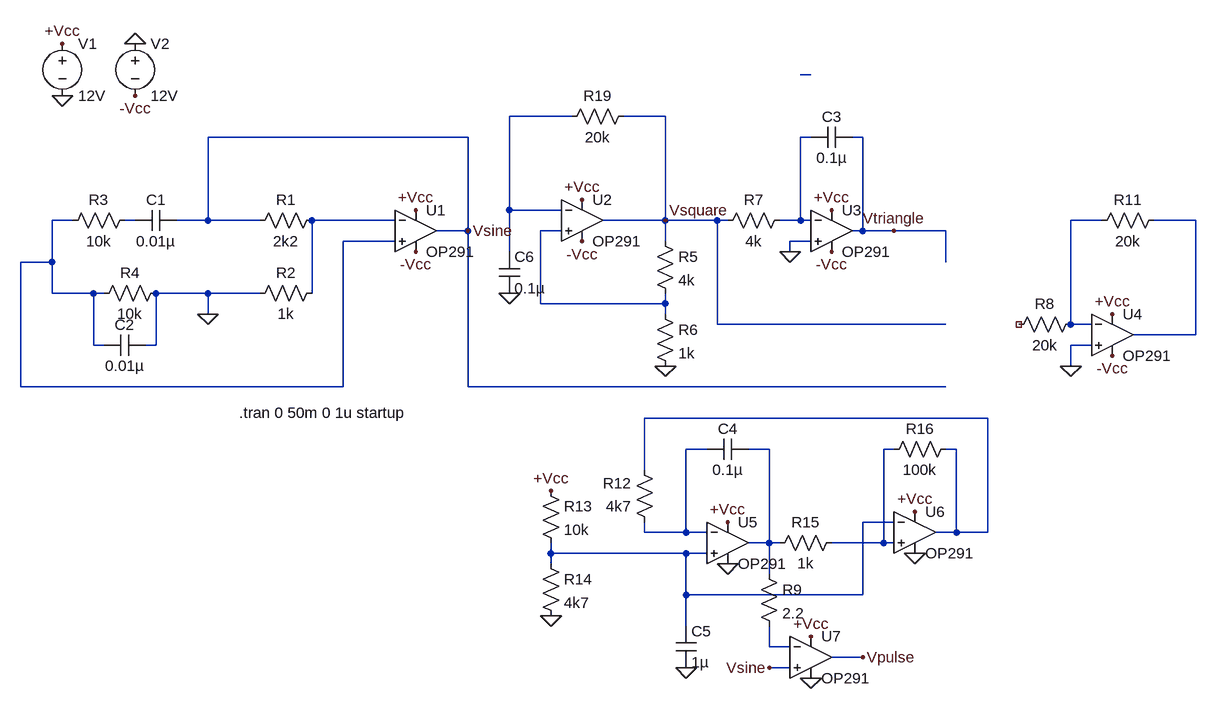
[diagram p0: schematic function_generator_seperated.asc]
function_generator_seperated.asc, the LTspice schematic file:
Version 4
SHEET 1 1520 1004
WIRE 816 -80 800 -80
WIRE 448 -16 352 -16
WIRE 592 -16 528 -16
WIRE 288 16 -112 16
WIRE 816 16 800 16
WIRE 896 16 880 16
WIRE 352 128 352 -16
WIRE 432 128 352 128
WIRE -320 144 -352 144
WIRE -224 144 -240 144
WIRE -112 144 -112 16
WIRE -112 144 -160 144
WIRE -32 144 -112 144
WIRE 176 144 48 144
WIRE 592 144 592 -16
WIRE 592 144 496 144
WIRE 672 144 592 144
WIRE 688 144 672 144
WIRE 800 144 800 16
WIRE 800 144 768 144
WIRE 816 144 800 144
WIRE 1264 144 1216 144
WIRE 1408 144 1344 144
WIRE 288 160 288 16
WIRE 288 160 240 160
WIRE 432 160 400 160
WIRE 896 160 896 16
WIRE 896 160 880 160
WIRE 944 160 896 160
WIRE 1024 160 944 160
WIRE 176 176 96 176
WIRE 592 176 592 144
WIRE 816 176 784 176
WIRE 352 192 352 128
WIRE 784 192 784 176
WIRE -352 208 -352 144
WIRE -352 208 -400 208
WIRE 1024 208 1024 160
WIRE -352 256 -352 208
WIRE -288 256 -352 256
WIRE -272 256 -288 256
WIRE -112 256 -192 256
WIRE -32 256 -112 256
WIRE 48 256 48 144
WIRE 400 272 400 160
WIRE 592 272 592 256
WIRE 592 272 400 272
WIRE -112 288 -112 256
WIRE 592 288 592 272
WIRE 672 304 672 144
WIRE 1024 304 672 304
WIRE 1216 304 1216 144
WIRE 1248 304 1216 304
WIRE 1408 320 1408 144
WIRE 1408 320 1312 320
WIRE -288 336 -288 256
WIRE -272 336 -288 336
WIRE -192 336 -192 256
WIRE -192 336 -208 336
WIRE 1248 336 1216 336
WIRE 1216 368 1216 336
WIRE -400 400 -400 208
WIRE 96 400 96 176
WIRE 96 400 -400 400
WIRE 288 400 288 160
WIRE 1024 400 288 400
WIRE 1088 448 560 448
WIRE 656 496 624 496
WIRE 752 496 720 496
WIRE 944 496 928 496
WIRE 1040 496 1024 496
WIRE 560 528 560 448
WIRE 944 608 896 608
WIRE 560 624 560 608
WIRE 624 624 624 496
WIRE 624 624 560 624
WIRE 656 624 624 624
WIRE 1040 624 1040 496
WIRE 1040 624 1008 624
WIRE 1088 624 1088 448
WIRE 1088 624 1040 624
WIRE 752 640 752 496
WIRE 752 640 720 640
WIRE 768 640 752 640
WIRE 928 640 928 496
WIRE 928 640 848 640
WIRE 944 640 928 640
WIRE 416 656 416 640
WIRE 624 656 416 656
WIRE 656 656 624 656
WIRE 416 672 416 656
WIRE 752 688 752 640
WIRE 624 720 624 656
WIRE 896 720 896 608
WIRE 896 720 624 720
WIRE 624 768 624 720
WIRE 752 800 752 768
WIRE 784 800 752 800
WIRE 896 816 848 816
WIRE 784 832 752 832
FLAG -112 288 0
FLAG 208 128 +Vcc
FLAG 208 192 -Vcc
FLAG 464 112 +Vcc
FLAG 464 176 -Vcc
FLAG -336 -48 0
FLAG -224 -128 0
FLAG -336 -128 +Vcc
FLAG -224 -48 -Vcc
FLAG 288 160 Vsine
FLAG 592 144 Vsquare
FLAG 592 368 0
FLAG 784 192 0
FLAG 848 128 +Vcc
FLAG 848 192 -Vcc
FLAG 944 160 Vtriangle
FLAG 416 560 +Vcc
FLAG 688 608 +Vcc
FLAG 416 752 0
FLAG 624 832 0
FLAG 688 672 0
FLAG 976 656 0
FLAG 976 592 +Vcc
FLAG 816 784 +Vcc
FLAG 896 816 Vpulse
FLAG 816 848 0
FLAG 352 256 0
FLAG 752 832 Vsine
FLAG 1280 352 -Vcc
FLAG 1280 288 +Vcc
FLAG 1216 368 0
SYMBOL res 64 128 R90
WINDOW 0 0 56 VBottom 2
WINDOW 3 32 56 VTop 2
SYMATTR InstName R1
SYMATTR Value 2k2
SYMBOL res 64 240 R90
WINDOW 0 0 56 VBottom 2
WINDOW 3 32 56 VTop 2
SYMATTR InstName R2
SYMATTR Value 1k
SYMBOL res -224 128 R90
WINDOW 0 0 56 VBottom 2
WINDOW 3 32 56 VTop 2
SYMATTR InstName R3
SYMATTR Value 10k
SYMBOL cap -160 128 R90
WINDOW 0 0 32 VBottom 2
WINDOW 3 32 32 VTop 2
SYMATTR InstName C1
SYMATTR Value 0.01µ
SYMBOL res -176 240 R90
WINDOW 0 0 56 VBottom 2
WINDOW 3 32 56 VTop 2
SYMATTR InstName R4
SYMATTR Value 10k
SYMBOL cap -208 320 R90
WINDOW 0 0 32 VBottom 2
WINDOW 3 32 32 VTop 2
SYMATTR InstName C2
SYMATTR Value 0.01µ
SYMBOL OpAmps\\OP291 464 80 R0
SYMATTR InstName U2
SYMBOL res 576 160 R0
SYMATTR InstName R5
SYMATTR Value 4k
SYMBOL res 576 272 R0
SYMATTR InstName R6
SYMATTR Value 1k
SYMBOL voltage -336 -144 R0
SYMATTR InstName V1
SYMATTR Value 12V
SYMBOL voltage -224 -144 R0
SYMATTR InstName V2
SYMATTR Value 12V
SYMBOL OpAmps\\OP291 208 96 R0
SYMATTR InstName U1
SYMBOL OpAmps\\OP291 848 96 R0
SYMATTR InstName U3
SYMBOL res 784 128 R90
WINDOW 0 0 56 VBottom 2
WINDOW 3 32 56 VTop 2
SYMATTR InstName R7
SYMATTR Value 4k
SYMBOL OpAmps\\OP291 688 576 R0
SYMATTR InstName U5
SYMBOL res 576 624 R180
WINDOW 0 36 76 Left 2
WINDOW 3 36 40 Left 2
SYMATTR InstName R12
SYMATTR Value 4k7
SYMBOL res 400 544 R0
SYMATTR InstName R13
SYMATTR Value 10k
SYMBOL res 400 656 R0
SYMATTR InstName R14
SYMATTR Value 4k7
SYMBOL res 864 624 R90
WINDOW 0 0 56 VBottom 2
WINDOW 3 32 56 VTop 2
SYMATTR InstName R15
SYMATTR Value 1k
SYMBOL cap 608 768 R0
SYMATTR InstName C5
SYMATTR Value 1µ
SYMBOL cap 720 480 R90
WINDOW 0 0 32 VBottom 2
WINDOW 3 32 32 VTop 2
SYMATTR InstName C4
SYMATTR Value 0.1µ
SYMBOL OpAmps\\OP291 976 560 R0
SYMATTR InstName U6
SYMBOL res 1040 480 R90
WINDOW 0 0 56 VBottom 2
WINDOW 3 32 56 VTop 2
SYMATTR InstName R16
SYMATTR Value 100k
SYMBOL OpAmps\\OP291 816 752 R0
SYMATTR InstName U7
SYMBOL res 544 -32 R90
WINDOW 0 0 56 VBottom 2
WINDOW 3 32 56 VTop 2
SYMATTR InstName R19
SYMATTR Value 20k
SYMBOL cap 336 192 R0
SYMATTR InstName C6
SYMATTR Value 0.1µ
SYMBOL cap 880 0 R90
WINDOW 0 0 32 VBottom 2
WINDOW 3 32 32 VTop 2
SYMATTR InstName C3
SYMATTR Value 0.1µ
SYMBOL OpAmps\\OP291 1280 256 R0
SYMATTR InstName U4
SYMBOL res 1360 128 R90
WINDOW 0 0 56 VBottom 2
WINDOW 3 32 56 VTop 2
SYMATTR InstName R11
SYMATTR Value 20k
SYMBOL res 1232 288 R90
WINDOW 0 0 56 VBottom 2
WINDOW 3 32 56 VTop 2
SYMATTR InstName R8
SYMATTR Value 20k
SYMBOL res 736 672 R0
SYMATTR InstName R9
SYMATTR Value 2.2
TEXT -64 440 Left 2 !.tran 0 50m 0 1u startup

The netlist it stands for:
* function_generator_seperated.asc
R1 N006 Vsine 2k2
R2 N006 0 1k
R3 N005 N004 10k
C1 Vsine N005 0.01µ
R4 0 N004 10k
C2 0 N004 0.01µ
XU2 N009 N002 +Vcc -Vcc Vsquare OP291  ; pins In+ In- V+ V- OUT
R5 Vsquare N009 4k
R6 N009 0 1k
V1 +Vcc 0 12V
V2 0 -Vcc 12V
XU1 N004 N006 +Vcc -Vcc Vsine OP291  ; pins In+ In- V+ V- OUT
XU3 0 N003 +Vcc -Vcc Vtriangle OP291  ; pins In+ In- V+ V- OUT
R7 N003 Vsquare 4k
XU5 N014 N011 +Vcc 0 N012 OP291  ; pins In+ In- V+ V- OUT
R12 N011 N010 4k7
R13 +Vcc N014 10k
R14 N014 0 4k7
R15 N013 N012 1k
C5 N014 0 1µ
C4 N012 N011 0.1µ
XU6 N013 N014 +Vcc 0 N010 OP291  ; pins In+ In- V+ V- OUT
R16 N010 N013 100k
XU7 Vsine N015 +Vcc 0 Vpulse OP291  ; pins In+ In- V+ V- OUT
R19 Vsquare N002 20k
C6 N002 0 0.1µ
C3 Vtriangle N003 0.1µ
XU4 0 N007 +Vcc -Vcc N008 OP291  ; pins In+ In- V+ V- OUT
R11 N008 N007 20k
R8 N007 NC_01 20k
R9 N012 N015 2.2
.tran 0 50m 0 1u startup
.backanno
.end